# EAGLE design Dirty P (EAGLE 7.4.0)
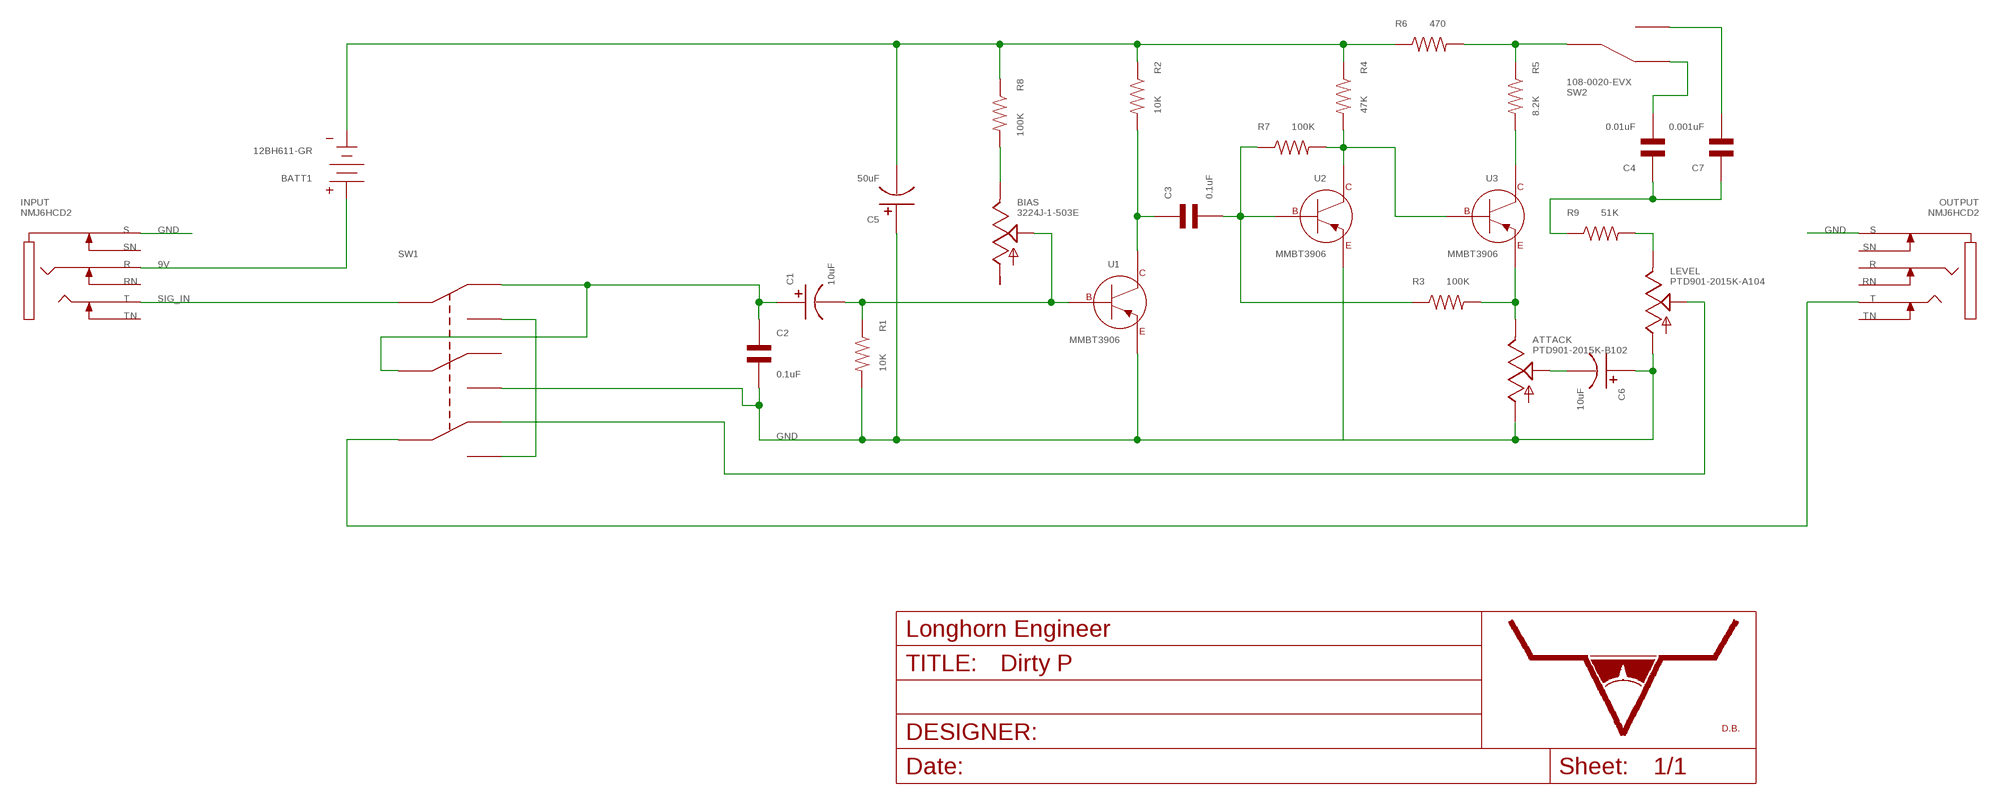
[diagram p0: schematic, sheet 1]

## Parts
ATTACK  PTD901-2015K-B102  POTENTIOMETERPTD901  [PTD901]
BATT1  12BH611-GR  BATTERY_12BH611-GR  [12BH611-GR]
BIAS  3224J-1-503E  POTENTIOMETER_3224J  [3224J]
C1  10uF  CAPACITOR_P_4MM  [CP4MM]
C2  0.1uF  CAPACITOR_NP_0805  [C0805]
C3  0.1uF  CAPACITOR_NP_0805  [C0805]
C4  0.01uF  CAPACITOR_NP_0805  [C0805]
C5  50uF  CAPACITOR_P_8MM  [CP8MM]
C6  10uF  CAPACITOR_P_4MM  [CP4MM]
C7  0.001uF  CAPACITOR_NP_0805  [C0805]
INPUT  NMJ6HCD2  TRS_SWITCHED_NMJ6HCD2  [NMJ6HCD2]
LEVEL  PTD901-2015K-A104  POTENTIOMETERPTD901  [PTD901]
OUTPUT  NMJ6HCD2  TRS_SWITCHED_NMJ6HCD2  [NMJ6HCD2]
R1  10K  RESISTOR_0805  [R0805]
R2  10K  RESISTOR_0805  [R0805]
R3  100K  RESISTOR_0805  [R0805]
R4  47K  RESISTOR_0805  [R0805]
R5  8.2K  RESISTOR_0805  [R0805]
R6  470  RESISTOR_0805  [R0805]
R7  100K  RESISTOR_0805  [R0805]
R8  100K  RESISTOR_0805  [R0805]
R9  51K  RESISTOR_0805  [R0805]
SW1  3PDT_STOMPBOX_SW  [STOMPBOX_SW]
SW2  108-0020-EVX  SPDT_108-0020-EVX  [108-0020-EVX]
U1  MMBT3906  PNP_BJT_SOT-23-3  [SOT-23-3]
U2  MMBT3906  PNP_BJT_SOT-23-3  [SOT-23-3]
U3  MMBT3906  PNP_BJT_SOT-23-3  [SOT-23-3]
U$1  LHE_FRAME  [LHE_FRAME]
U$2  DB_LOGO_COPPER_MEDIUM  [DB_COPPER_MEDIUM]

## Nets
9V: BATT1.+ INPUT.R
GND: ATTACK.P$3 C2.P$2 C5.P$1 C6.P$1 INPUT.S LEVEL.P$3 OUTPUT.S R1.P$2 SW1.B3 SW1.B6 U1.P$2(EMITTER) U2.P$2(EMITTER)
N$1: BIAS.2 C1.P$2 R1.P$1 U1.P$1(BASE)
N$2: C3.P$2 R3.P$1 R7.P$1 U2.P$1(BASE)
N$3: C3.P$1 R2.P$2 U1.P$3(COLLECTOR)
N$4: BATT1.- C5.P$2 R2.P$1 R4.P$1 R6.P$1 R8.P$1
N$5: R5.P$1 R6.P$2 SW2.P$2(C)
N$6: R4.P$2 R7.P$2 U2.P$3(COLLECTOR) U3.P$1(BASE)
N$7: R5.P$2 U3.P$3(COLLECTOR)
N$8: ATTACK.P$1 R3.P$2 U3.P$2(EMITTER)
N$9: ATTACK.P$2 C6.P$2
N$10: LEVEL.P$1 R9.P$2
N$11: OUTPUT.T SW1.C2 SW1.C5
N$12: BIAS.3 R8.P$2
N$13: C4.P$1 C7.P$1 R9.P$1
N$14: C1.P$1 C2.P$1 SW1.A1 SW1.A4 SW1.B2 SW1.B5
N$15: C4.P$2 SW2.P$1
N$16: C7.P$2 SW2.P$3
N$17: SW1.A3 SW1.A6 SW1.C3 SW1.C6
N$19: LEVEL.P$2 SW1.C1 SW1.C4
SIG_IN: INPUT.T SW1.A2 SW1.A5
Unconnected: BIAS.1 INPUT.RN INPUT.SN INPUT.TN OUTPUT.R OUTPUT.RN OUTPUT.SN OUTPUT.TN SW1.B1 SW1.B4

## Library data of the parts
ATTACK LEVEL = PP_Electromechanical:POTENTIOMETER
BATT1 = PP_Connectors:BATTERY
BIAS = PP_Passives:POTENTIOMETER
C1 C5 C6 = MF_Passives:CAPACITOR_P: Library: MF_Passives Description: Device for Polarized Capacitors. Manufacture part number (MFG#), Voltage Rating, and Tolerance can be added via Attributes.; MFG#: N/A; TOLERANCE: N/A; VOLTAGE: N/A
C2-C4 C7 = MF_Passives:CAPACITOR_NP: Library: MF_Passives Description: Device for Non-Polarized Capacitors. Manufacture part number (MFG#), Voltage, Temperature Coefficient, and Tolerance can be added via Attributes.; MFG#: N/A; TEMP_COF: N/A; TOLERANCE: N/A; VOLTAGE: N/A
INPUT OUTPUT = PP_Connectors:TRS_SWITCHED
R1-R9 = MF_Passives:RESISTOR: Library: MF_Passives Description: Device for Resistors. Manufacture part number (MFG#), Voltage, Tolerance, and Wattage Rating can be added via Attributes.; MFG#: N/A; TOLERANCE: N/A; VOLTAGE: N/A; WATTAGE: N/A
SW1 = PP_Electromechanical:3PDT
SW2 = PP_Electromechanical:SPDT
U1-U3 = MF_Discrete_Semiconductor:PNP_BJT: Library: MF_Discrete_Semiconductor Description: Device for Single PNP BJT Transistors. Manufacture part number (MFG#) can be added via Attributes.; MFG#: N/A
U$1 = PP_Aesthetics:LHE_FRAME; DNAME: Parker Dillmann; REVNUM: REV: 3
U$2 = PP_Aesthetics:DB_LOGO

## Board
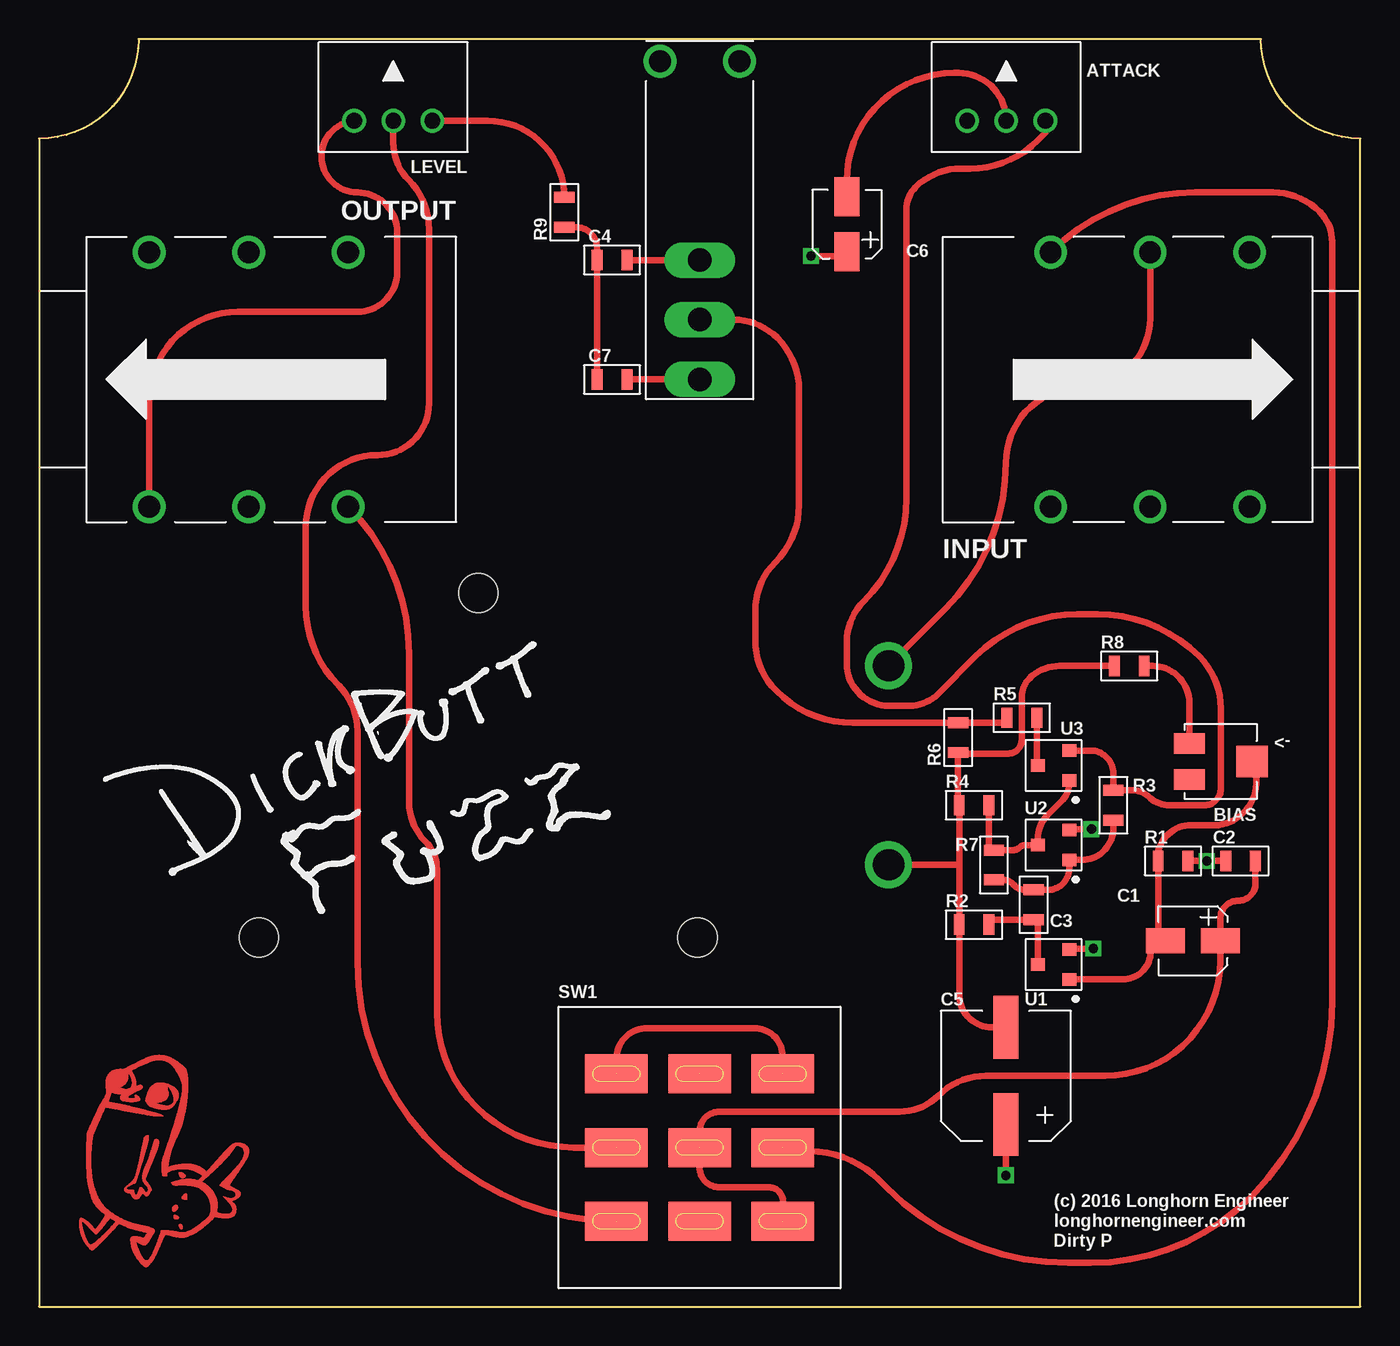
[diagram p1: board, top side]
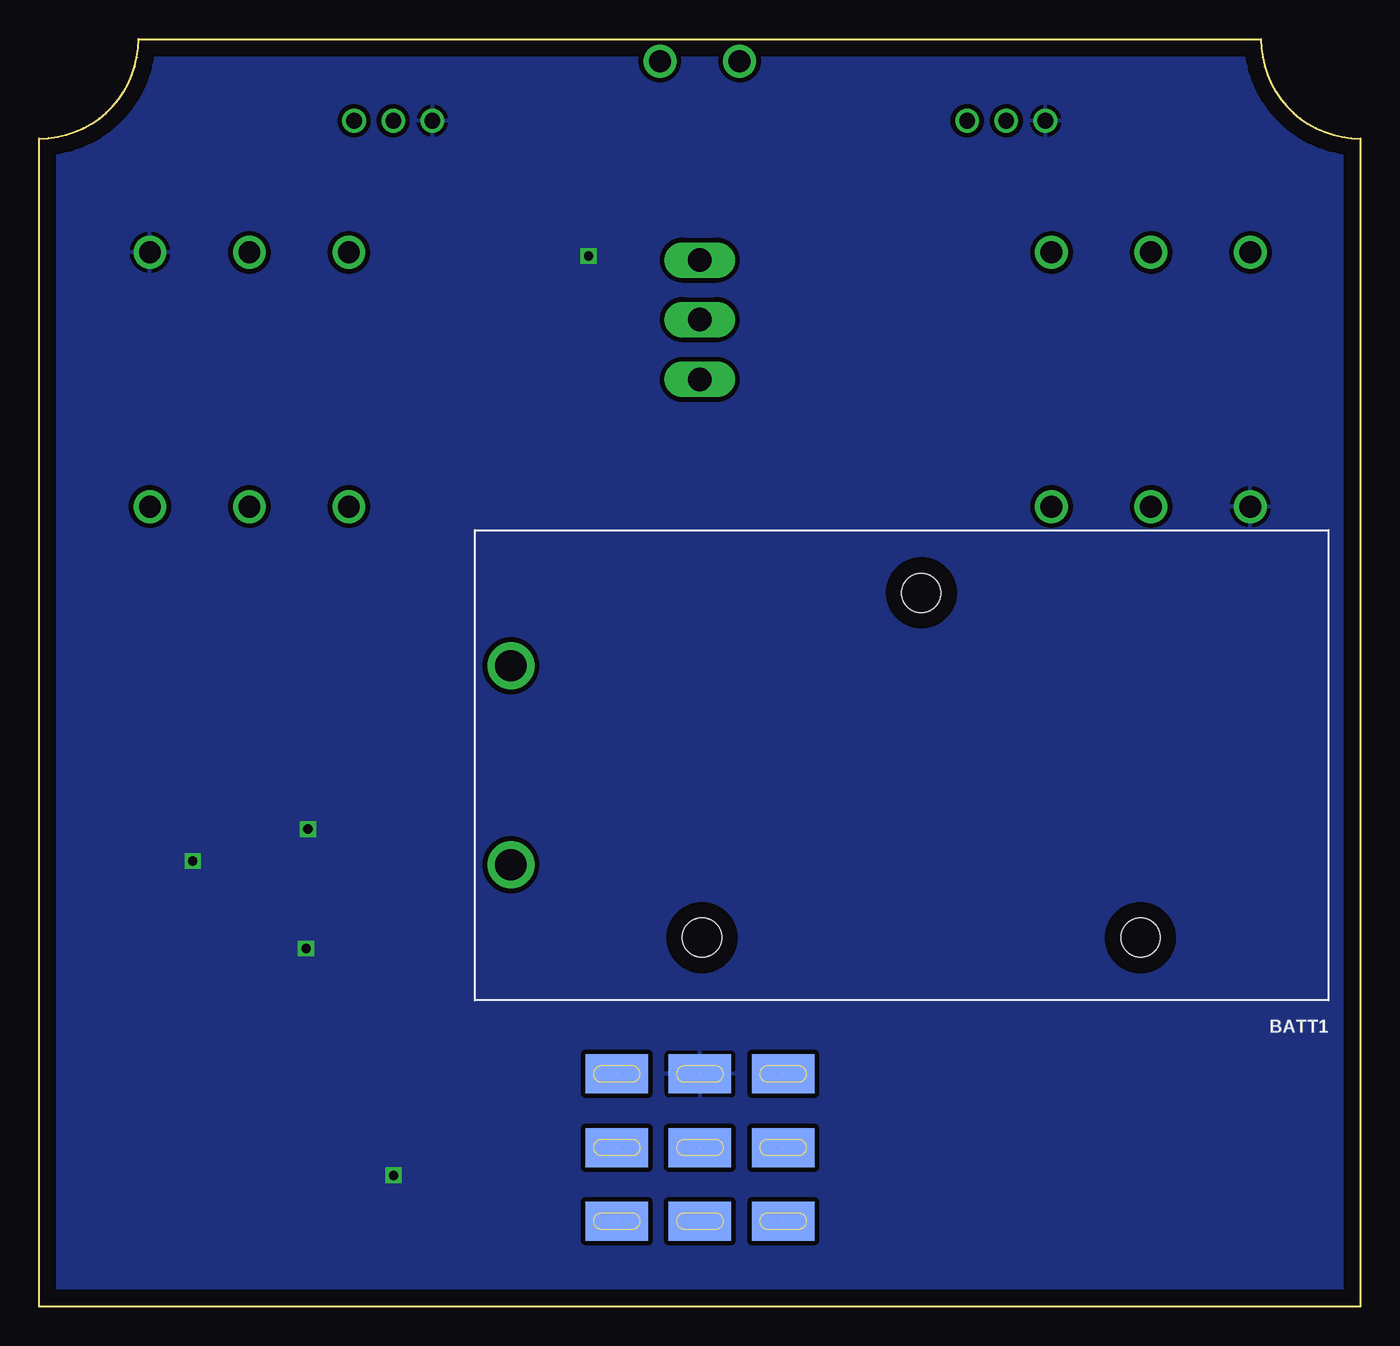
[diagram p2: board, bottom side, seen from below]

Size 84.35 x 80.9 mm. Coordinates in mm from the lower left corner, seen from the top.
Outline: 0,0 84.35,0 84.35,74.55 arc-90 78,80.9 6.35,80.9 arc-90 0,74.55 0,0
Copper layers (1*16): Top 0.035mm / dielectric 1.5mm / Bottom 0.035mm
Design rules "default": minimum track width 10mil, minimum drill 24mil, track to track 8mil, track to pad 8mil, pad to pad 8mil, via to via 8mil, smd to smd 8mil, copper to edge 40mil, drill to drill 8mil, minimum pad ring 10mil, minimum via ring 8mil, stop-mask expansion 4mil, vias tented up to drill 0mil, thermal gap 10mil

### Footprints (pad centres in the part's own frame; a part is rotated, then mirrored left to right if it is on the bottom)
PTD901 = drill 1: P$1 -2.5,0; P$2 0,0; P$3 2.5,0
12BH611-GR = drill 2: + 52.2,-21.35; - 52.2,-8.65 | hole 2.5: 12,-4; 40,-4; 26,-26
3224J = smd 2 x 1.3: 1 2,1.15; 3 2,-1.15 | smd 2 x 2: 2 -2,0
CP4MM = smd 1.6 x 2.5: P$1 0,-1.75; P$2 0,1.75
C0805 = smd 0.7 x 1.3: P$1 -0.95,0; P$2 0.95,0
CP8MM = smd 1.6 x 4: P$1 0,-3.1; P$2 0,3.1
NMJ6HCD2 = drill 1.4: R -10.35,8.115; RN -10.35,-8.115; S -4,8.115; SN -4,-8.115; T -16.7,8.115; TN -16.7,-8.115
R0805 = smd 0.7 x 1.3: P$1 -0.95,0; P$2 0.95,0
STOMPBOX_SW = smd 3.988 x 2.489: A1 -5.309,4.699; A2 -5.309,0; A3 -5.309,-4.699; B1 0,4.699; B2 0,0; B3 0,-4.699; C1 5.309,4.699; C2 5.309,0; C3 5.309,-4.699 | smd 3.988 x 2.489 bottom: A4 -5.309,4.699; A5 -5.309,0; A6 -5.309,-4.699; B4 0,4.699; B5 0,0; B6 0,-4.699; C4 5.309,4.699; C5 5.309,0; C6 5.309,-4.699
108-0020-EVX = drill 1.5 long: P$1 0,0; P$2 0,3.81; P$3 0,7.62 | drill 1.4: P$4 -2.54,-12.7; P$5 2.54,-12.7
SOT-23-3 = smd 0.8 x 0.9: P$1 -0.95,-1; P$2 0.95,-1; P$3 0,1

### Placement (x,y rotation side)
ATTACK  61.75,75.69 180 top
BATT1  2.03,19.56 180 bottom
BIAS  75.44,34.8 180 top
C1  73.66,23.37 90 top
C2  76.71,28.45 180 top
C3  63.5,25.65 90 top
C4  36.58,66.8 0 top
C5  61.72,14.73 0 top
C6  51.56,69.09 0 top
C7  36.58,59.18 0 top
INPUT  81.28,59.18 0 top
LEVEL  22.61,75.69 180 top
OUTPUT  3.02,59.18 180 top
R1  72.39,28.45 0 top
R2  59.69,24.38 0 top
R3  68.58,32 90 top
R4  59.69,32 0 top
R5  62.74,37.59 0 top
R6  58.67,36.32 90 top
R7  60.96,28.19 90 top
R8  69.6,40.89 0 top
R9  33.53,69.85 90 top
SW1  42.16,10.16 180 top
SW2  42.18,66.8 180 top
U1  64.77,21.84 90 top
U2  64.77,29.46 90 top
U3  64.77,34.54 90 top
U$1  64.77,1.27 0 top
U$2  2.54,2.54 0 top

### Tracks (layer width: path | path; a pad name or v marks a point on that pad's centre or on a via)
9V
  Top 0.406: BATT1.+ 57.85,44.53 arc45 61.72,53.87 arc-90 66.53,58.67 arc90 70.93,63.07 INPUT.R
GND  (via drill 0.6)  (1 unrouted)
  Top 0.406: U1.P$2 65.84,22.86 v67.31,22.86 | U2.P$2 65.84,30.48 v67.18,30.48 | C2.P$2 v74.55,28.45 R1.P$2 | C5.P$1 v61.72,8.38 | C6.P$1 51.56,67.06 v49.28,67.06 | OUTPUT.S 7.02,57.82 arc-90 12.7,63.5 20.32,63.5 arc90 22.86,66.04 22.86,68.58 arc90 20.32,71.12 arc-175 LEVEL.P$3
  pour Bottom (isolate 0.305): 0,81.28 84.33,81.28 84.33,0 0,0
N$1
  Top 0.406: U1.P$1 69.2,20.89 arc90 70.96,22.66 C1.P$2 71.44,23.37 R1.P$1 71.37,28.51 71.37,28.55 arc-90 73.56,30.73 75.3,30.73 arc90 77.69,33.89 BIAS.2
N$2
  Top 0.406: R7.P$1 61.52,27.24 arc-45 62.19,26.97 62.29,26.87 arc45 62.92,26.6 C3.P$2 64.39,26.6 arc90 65.77,27.98 U2.P$1 66.56,28.51 arc90 68.58,30.53 R3.P$1
N$3
  Top 0.406: U1.P$3 63.77,24.7 C3.P$1 60.64,24.7 R2.P$2
N$4
  Top 0.406: 58.74,28.19 R4.P$1 58.67,32.07 R6.P$1 58.74,35.31 61.9,35.31 arc45 62.47,35.54 arc45 62.74,36.2 62.74,38.96 arc-45 63.21,40.09 arc-45 65.14,40.89 R8.P$1 | 58.74,28.19 R2.P$1 58.74,19.94 arc90 60.84,17.83 C5.P$2 | BATT1.- 54.25,28.19 58.74,28.19
N$5
  Top 0.406: R5.P$1 61.47,37.27 R6.P$2 51.95,37.27 arc-45 47.06,39.3 arc-45 45.72,42.54 45.72,44.41 arc-45 47.01,47.52 arc45 48.51,51.15 48.51,58.51 arc45 47.14,61.83 arc45 44.33,62.99 SW2.P$2
N$6
  Top 0.406: R4.P$2 60.64,29.46 R7.P$2 62.2,29.14 arc45 62.57,29.3 arc-45 62.97,29.46 U2.P$3 63.75,29.48 63.75,29.89 arc-45 64.35,31.33 65.27,32.25 arc45 65.77,33.45 U3.P$1
N$7
  Top 0.406: R5.P$2 63.69,34.54 U3.P$3
N$8
  Top 0.406: U3.P$2 67.12,35.49 arc-90 68.58,34.04 R3.P$2 69.87,32.95 arc-45 70.81,32.56 arc45 72.17,32 74.39,32 arc90 75.44,33.05 75.44,38.2 arc45 74.07,41.5 arc45 67.56,44.2 66.3,44.2 arc45 59.79,41.5 57.41,39.12 arc-45 55.56,38.35 54.26,38.35 arc-90 51.56,41.05 51.56,42.39 arc-45 52.66,45.04 arc45 55.37,51.59 55.37,70.04 arc-45 55.95,71.45 arc-45 58.84,72.64 59.43,72.64 arc45 63.77,74.44 64.25,74.92 ATTACK.P$1
N$9
  Top 0.406: C6.P$2 51.56,71.88 arc-90 58.42,78.74 58.7,78.74 arc-90 ATTACK.P$2
N$10
  Top 0.406: LEVEL.P$1 28.64,75.69 arc-90 R9.P$2
N$11  (1 unrouted)
  Top 0.406: OUTPUT.T arc-45 23.62,41.65 23.62,32.16 arc45 24.63,29.72 arc-45 25.4,27.87 25.4,18.76 arc45 27.89,12.75 arc45 34.14,10.16 SW1.C2
N$12
  Top 0.406: BIAS.3 73.44,38.53 arc90 71.08,40.89 R8.P$2
N$13
  Top 0.406: C7.P$1 C4.P$1 35.63,67.54 arc90 34.26,68.9 R9.P$1
N$14  (2 unrouted)
  Top 0.406: SW1.A1 47.5,5.49 47.5,6.7 arc90 46.58,7.62 43.43,7.62 arc-90 42.16,8.89 SW1.B2 42.16,11.18 arc-90 43.43,12.45 54.93,12.45 arc45 57.42,13.48 arc-45 60.45,14.73 68.04,14.73 arc90 75.41,22.1 C1.P$1 75.41,24.76 arc-90 76.56,25.91 arc90 77.66,27.01 C2.P$1
N$15
  Top 0.406: SW2.P$1 C4.P$2
N$16
  Top 0.406: SW2.P$3 C7.P$2
N$17  (2 unrouted)
  Top 0.406: SW1.C6 36.85,15.81 arc-90 38.82,17.78 45.66,17.78 arc-90 47.47,15.96 SW1.A3
N$19  (1 unrouted)
  Top 0.406: SW1.C4 arc-90 20.32,22 20.32,36.74 arc45 19.11,39.67 arc-45 17.02,44.71 17.02,49.78 arc-90 21.6,54.36 arc90 24.89,57.65 24.89,68.77 arc45 23.59,71.91 arc-45 22.61,74.29 LEVEL.P$2
SIG_IN  (1 unrouted)
  Top 0.406: INPUT.T arc-45 73.81,71.12 78.77,71.12 arc-45 81.76,69.88 arc-45 82.55,67.97 82.55,19.46 arc-45 77.41,7.05 arc-45 67.13,2.79 65.7,2.79 arc-45 54.14,7.58 53.65,8.07 arc45 49.22,9.91 46.99,9.91 47.24,10.16 SW1.A2